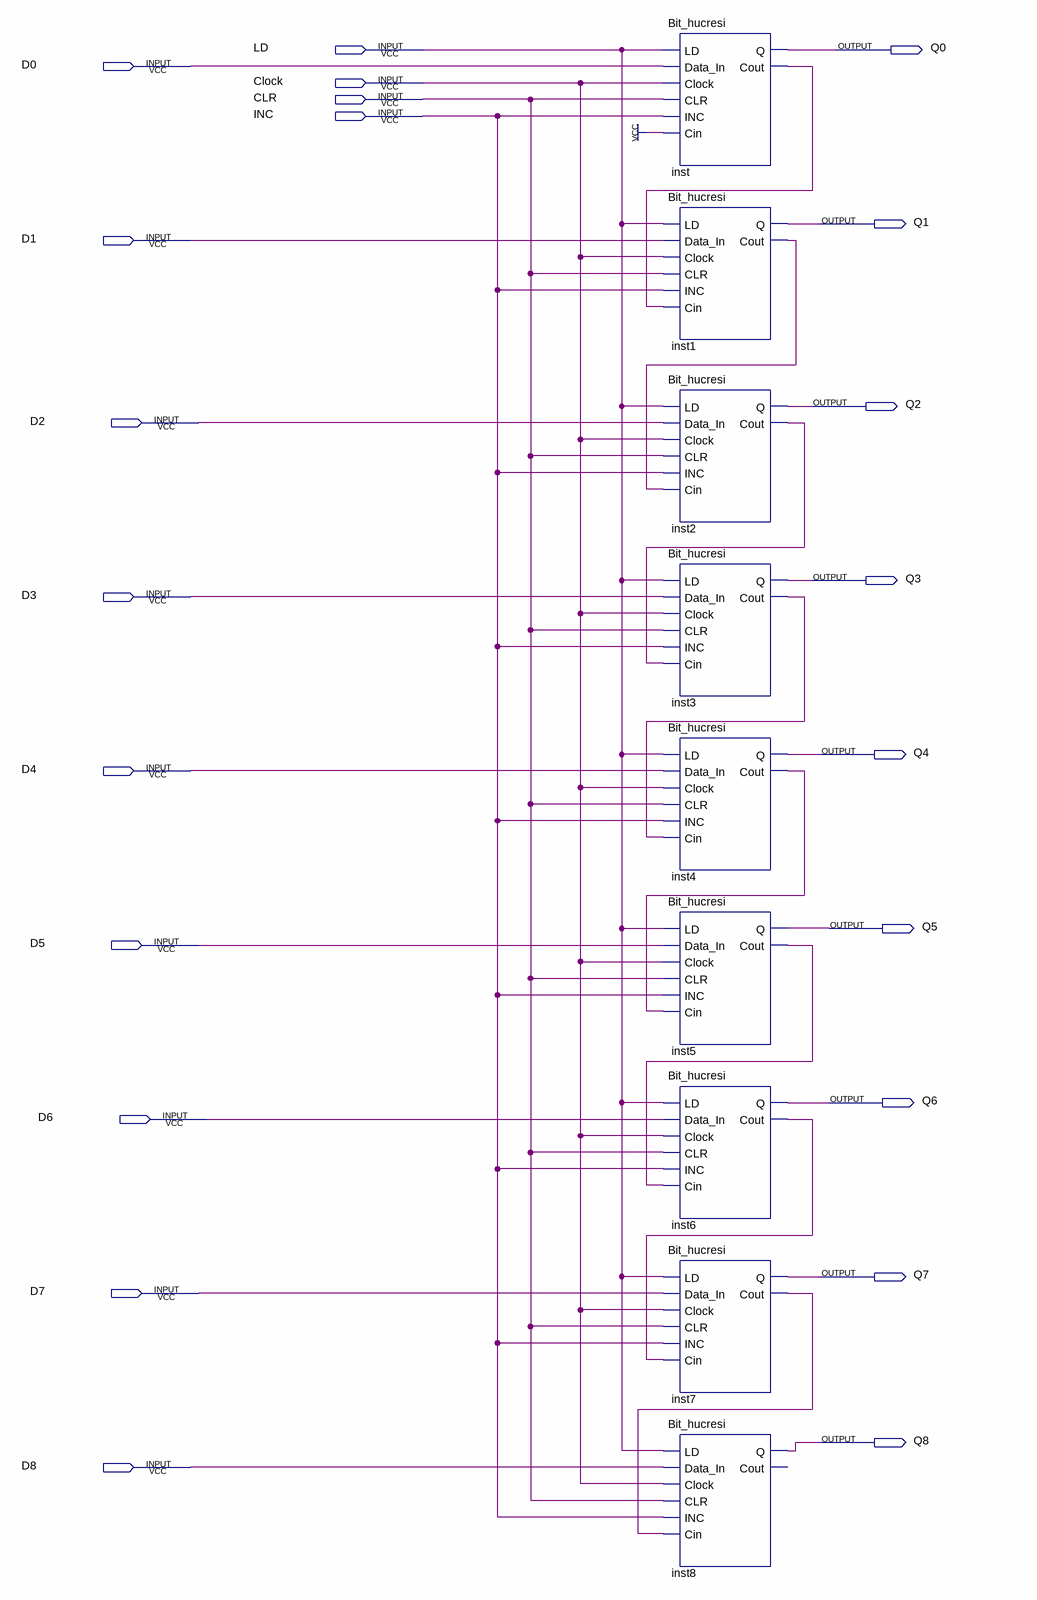
[diagram p0: schematic sheet]
// Quartus schematic Register_9bit.bdf as structural Verilog: 9 symbols, 22 pins
module Register_9bit (
  input  LD,
  input  D0,
  input  Clock,
  input  CLR,
  input  INC,
  input  D1,
  input  D2,
  input  D3,
  input  D4,
  input  D5,
  input  D6,
  input  D7,
  input  D8,
  output Q0,
  output Q1,
  output Q2,
  output Q3,
  output Q4,
  output Q5,
  output Q6,
  output Q7,
  output Q8
);

  wire inst1_cout, inst2_cout, inst3_cout, inst4_cout, inst5_cout, inst6_cout, inst7_cout, inst_cout;

  Bit_hucresi inst (.LD(LD), .Data_In(D0), .Clock(Clock), .CLR(CLR), .INC(INC), .Cin(1'b1), .Q(Q0), .Cout(inst_cout));
  Bit_hucresi inst1 (
    .LD(LD), .Data_In(D1), .Clock(Clock), .CLR(CLR), .INC(INC), .Cin(inst_cout), .Q(Q1), .Cout(inst1_cout));
  Bit_hucresi inst2 (
    .LD(LD), .Data_In(D2), .Clock(Clock), .CLR(CLR), .INC(INC), .Cin(inst1_cout), .Q(Q2), .Cout(inst2_cout));
  Bit_hucresi inst3 (
    .LD(LD), .Data_In(D3), .Clock(Clock), .CLR(CLR), .INC(INC), .Cin(inst2_cout), .Q(Q3), .Cout(inst3_cout));
  Bit_hucresi inst4 (
    .LD(LD), .Data_In(D4), .Clock(Clock), .CLR(CLR), .INC(INC), .Cin(inst3_cout), .Q(Q4), .Cout(inst4_cout));
  Bit_hucresi inst5 (
    .LD(LD), .Data_In(D5), .Clock(Clock), .CLR(CLR), .INC(INC), .Cin(inst4_cout), .Q(Q5), .Cout(inst5_cout));
  Bit_hucresi inst6 (
    .LD(LD), .Data_In(D6), .Clock(Clock), .CLR(CLR), .INC(INC), .Cin(inst5_cout), .Q(Q6), .Cout(inst6_cout));
  Bit_hucresi inst7 (
    .LD(LD), .Data_In(D7), .Clock(Clock), .CLR(CLR), .INC(INC), .Cin(inst6_cout), .Q(Q7), .Cout(inst7_cout));
  Bit_hucresi inst8 (
    .LD(LD), .Data_In(D8), .Clock(Clock), .CLR(CLR), .INC(INC), .Cin(inst7_cout), .Q(Q8));  // open: Cout
endmodule
